# Altium schematic sheet GPS.SchDoc
size A4
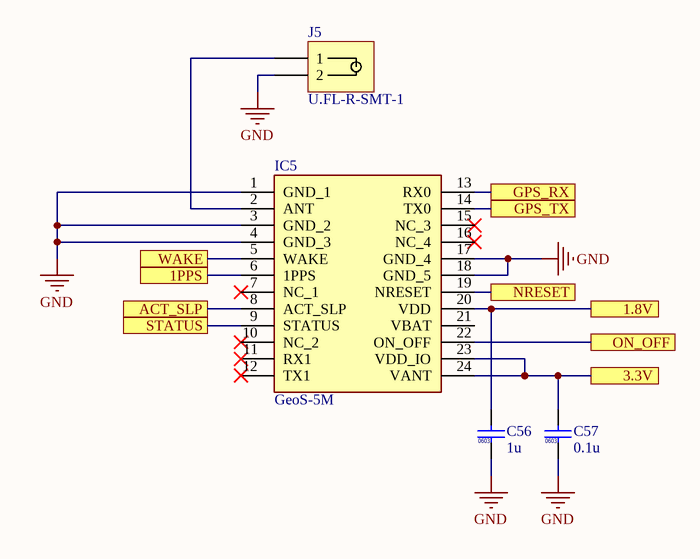
[diagram p0: GPS.SchDoc]

## Parts
C56  value 1u  [CAPC1608-0603L]  (hidden comment: CAPC_0603)
C57  value 0.1u  [CAPC1608-0603L]  (hidden comment: CAPC_0603)
IC5  GeoS-5M  [GeoS5M]
J5  U.FL-R-SMT-1  [HIROSE_U.FL-R-SMT-1(10)]

## Ports
1.8V, 1PPS, 3.3V, ACT_SLP, GPS_RX, GPS_TX, NRESET, ON_OFF, STATUS, WAKE

## Nets
GND: C56.1 C57.1 IC5.1(GND_1) IC5.3(GND_2) IC5.4(GND_3) IC5.17(GND_4) IC5.18(GND_5) J5.2
1.8V: C56.2 IC5.20(VDD) ; port 1.8V
1PPS: IC5.6(1PPS) ; port 1PPS
3.3V: C57.2 IC5.23(VDD_IO) IC5.24(VANT) ; port 3.3V
ACT_SLP: IC5.8(ACT_SLP) ; port ACT_SLP
GPS_RX: IC5.13(RX0) ; port GPS_RX
GPS_TX: IC5.14(TX0) ; port GPS_TX
NRESET: IC5.19(NRESET) ; port NRESET
ON_OFF: IC5.22(ON_OFF) ; port ON_OFF
STATUS: IC5.9(STATUS) ; port STATUS
WAKE: IC5.5(WAKE) ; port WAKE
NetIC5_2: IC5.2(ANT) J5.1

Not connected (* = marked no-connect by the designer): IC5 7(NC_1)* 10(NC_2)* 11(RX1)* 12(TX1)* 15(NC_3)* 16(NC_4)* 21(VBAT)

## Notes on the sheet
- (in symbol CAPC_0603) 0603

## Library data of the parts
C56 C57 = CAPC_0603: Capacitor 0603
IC5 = GeoS-5M: Integrated Circuit; Manufacturer_Name: Geostar; Datasheet Link: http://geostar-navi.com/files/docs/geos5/GeoS-5M_DataSheet_Rev1.1_ENG.pdf; Height: 2mm; Manufacturer_Part_Number: GeoS-5M
J5 = U.FL-R-SMT-1: Hirose U.FL-R-SMT-1 HF connector